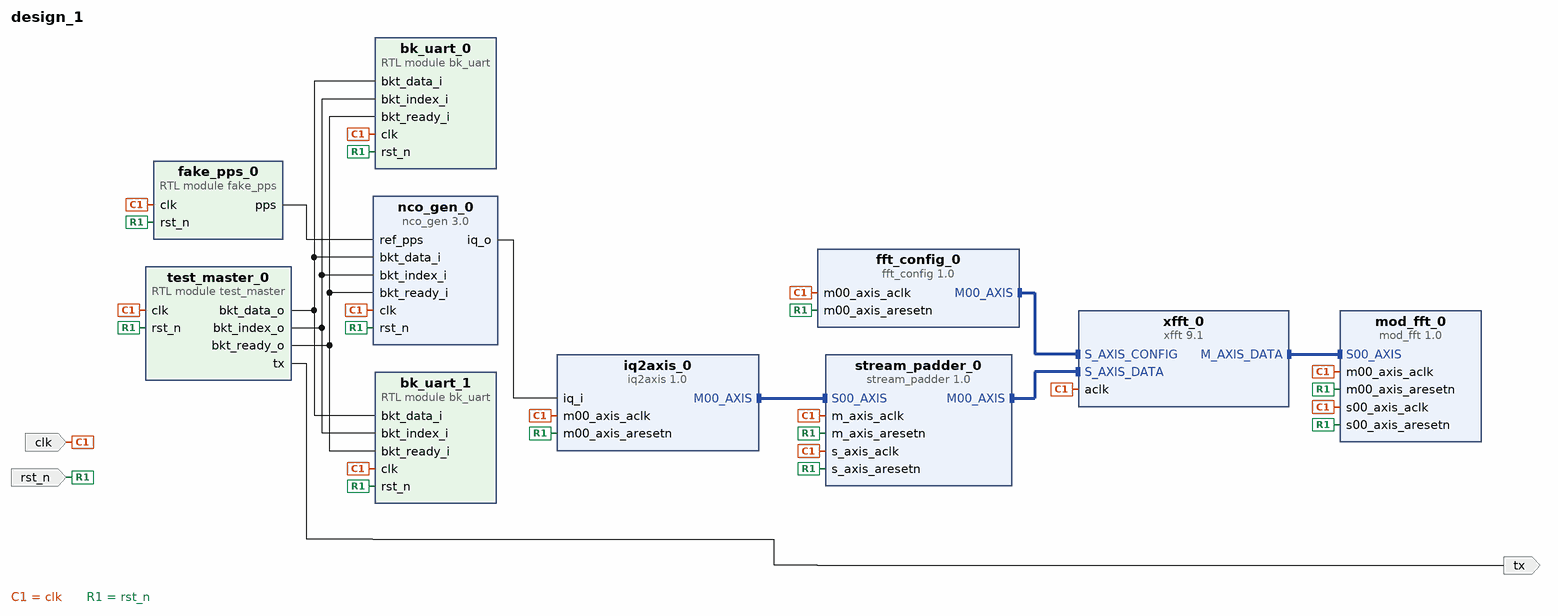
[diagram p0: block diagram of the top level]
# Vivado block design design_1, xc7z020clg400-1, Vivado 2022.1
create_bd_design design_1

create_bd_port -dir O tx
create_bd_port -dir I -type clk clk
set_property -dict {CONFIG.ASSOCIATED_RESET rst_n} [get_bd_ports clk]
create_bd_port -dir I -type rst rst_n

create_bd_cell -type ip -vlnv xilinx.com:ip:xfft:9.1 xfft_0
set_property -dict [list \
  CONFIG.data_format fixed_point \
  CONFIG.implementation_options pipelined_streaming_io \
  CONFIG.input_width 16 \
  CONFIG.number_of_stages_using_block_ram_for_data_and_phase_factors 5 \
  CONFIG.output_ordering natural_order \
  CONFIG.phase_factor_width 24 \
  CONFIG.scaling_options unscaled \
  CONFIG.target_clock_frequency 100 \
  CONFIG.target_data_throughput 50 \
  CONFIG.transform_length 4096 \
  CONFIG.xk_index true \
] [get_bd_cells xfft_0]
create_bd_cell -type module -reference fake_pps fake_pps_0
create_bd_cell -type module -reference test_master test_master_0
create_bd_cell -type ip -vlnv xilinx.com:user:iq2axis:1.0 iq2axis_0
set_property -dict {CONFIG.C_M00_AXIS_START_COUNT 100000} [get_bd_cells iq2axis_0]
create_bd_cell -type ip -vlnv xilinx.com:user:nco_gen:3.0 nco_gen_0
set_property -dict {CONFIG.NCO_nums 1 CONFIG.timer_delay 320000} [get_bd_cells nco_gen_0]
create_bd_cell -type module -reference bk_uart bk_uart_0
create_bd_cell -type module -reference bk_uart bk_uart_1
create_bd_cell -type ip -vlnv xilinx.com:user:stream_padder:1.0 stream_padder_0
set_property -dict {CONFIG.DMA_BYTES 8192 CONFIG.TOTAL_BYTES 16384} [get_bd_cells stream_padder_0]
create_bd_cell -type ip -vlnv xilinx.com:user:fft_config:1.0 fft_config_0
set_property -dict {CONFIG.C_M00_AXIS_TDATA_WIDTH 8} [get_bd_cells fft_config_0]
create_bd_cell -type ip -vlnv xilinx.com:user:mod_fft:1.0 mod_fft_0
set_property -dict {CONFIG.C_M00_AXIS_TDATA_WIDTH 32 CONFIG.C_S00_AXIS_TDATA_WIDTH 64} [get_bd_cells mod_fft_0]

# ---- connections ----

connect_bd_intf_net [get_bd_intf_pins fft_config_0/M00_AXIS] [get_bd_intf_pins xfft_0/S_AXIS_CONFIG]
connect_bd_intf_net [get_bd_intf_pins stream_padder_0/S00_AXIS] [get_bd_intf_pins iq2axis_0/M00_AXIS]
connect_bd_intf_net [get_bd_intf_pins stream_padder_0/M00_AXIS] [get_bd_intf_pins xfft_0/S_AXIS_DATA]
connect_bd_intf_net [get_bd_intf_pins xfft_0/M_AXIS_DATA] [get_bd_intf_pins mod_fft_0/S00_AXIS]
connect_bd_net -net clk_0_1 [get_bd_ports clk] \
  [get_bd_pins xfft_0/aclk] [get_bd_pins fake_pps_0/clk] [get_bd_pins test_master_0/clk] \
  [get_bd_pins iq2axis_0/m00_axis_aclk] [get_bd_pins nco_gen_0/clk] [get_bd_pins bk_uart_0/clk] [get_bd_pins bk_uart_1/clk] \
  [get_bd_pins stream_padder_0/s_axis_aclk] [get_bd_pins stream_padder_0/m_axis_aclk] \
  [get_bd_pins fft_config_0/m00_axis_aclk] [get_bd_pins mod_fft_0/s00_axis_aclk] [get_bd_pins mod_fft_0/m00_axis_aclk]
connect_bd_net [get_bd_pins fake_pps_0/pps] [get_bd_pins nco_gen_0/ref_pps]
connect_bd_net [get_bd_pins nco_gen_0/iq_o] [get_bd_pins iq2axis_0/iq_i]
connect_bd_net -net rst_n_0_1 [get_bd_ports rst_n] \
  [get_bd_pins fake_pps_0/rst_n] [get_bd_pins test_master_0/rst_n] [get_bd_pins iq2axis_0/m00_axis_aresetn] \
  [get_bd_pins nco_gen_0/rst_n] [get_bd_pins bk_uart_0/rst_n] [get_bd_pins bk_uart_1/rst_n] \
  [get_bd_pins stream_padder_0/s_axis_aresetn] [get_bd_pins stream_padder_0/m_axis_aresetn] \
  [get_bd_pins fft_config_0/m00_axis_aresetn] [get_bd_pins mod_fft_0/s00_axis_aresetn] \
  [get_bd_pins mod_fft_0/m00_axis_aresetn]
connect_bd_net [get_bd_pins test_master_0/bkt_data_o] \
  [get_bd_pins nco_gen_0/bkt_data_i] [get_bd_pins bk_uart_0/bkt_data_i] [get_bd_pins bk_uart_1/bkt_data_i]
connect_bd_net [get_bd_pins test_master_0/bkt_index_o] \
  [get_bd_pins nco_gen_0/bkt_index_i] [get_bd_pins bk_uart_0/bkt_index_i] [get_bd_pins bk_uart_1/bkt_index_i]
connect_bd_net [get_bd_pins test_master_0/bkt_ready_o] \
  [get_bd_pins nco_gen_0/bkt_ready_i] [get_bd_pins bk_uart_0/bkt_ready_i] [get_bd_pins bk_uart_1/bkt_ready_i]
connect_bd_net [get_bd_pins test_master_0/tx] [get_bd_ports tx]

validate_bd_design
save_bd_design
